# Altium schematic sheet Sheet_3.3VTo12V.SchDoc
size A4
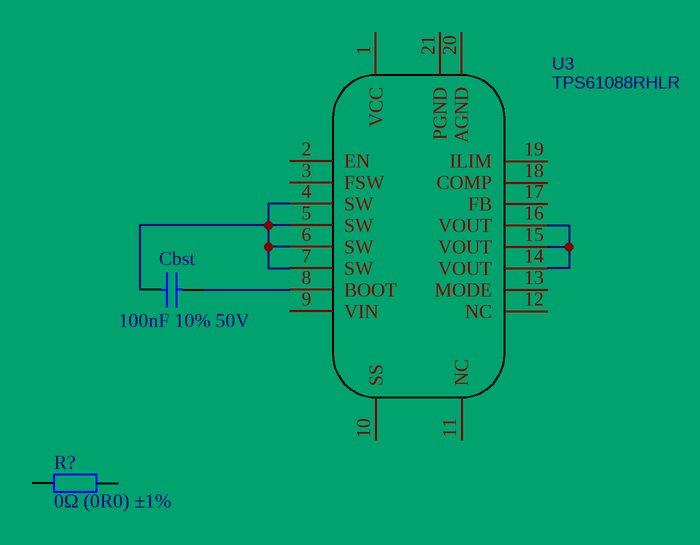
[diagram p0: Sheet_3.3VTo12V.SchDoc]

## Parts
Cbst  100nF 10% 50V  [1206_C]
R?  0Ω (0R0) ±1%  [1206_R]
U3  TPS61088RHLR  [VQFN-20_L4.6-W3.6-P0.50-BL]

## Nets
NetCbst_1: Cbst.1 U3.8(BOOT)
NetCbst_2: Cbst.2 U3.4(SW) U3.5(SW) U3.6(SW) U3.7(SW)
NetU3_14: U3.14(VOUT) U3.15(VOUT) U3.16(VOUT)

Not connected (* = marked no-connect by the designer): R? 1 2; U3 1(VCC) 2(EN) 3(FSW) 9(VIN) 10(SS) 11(NC) 12(NC) 13(MODE) 17(FB) 18(COMP) 19(ILIM) 20(AGND) 21(PGND)

## Library data of the parts
Cbst = 1206 1uF (105) 10% 50V: 贴片电容; ComponentLink1Description: 供应商链接; ComponentLink1URL: http://www.szlcsc.com/product/details_2200.html; Package: 1206; Supplier: LC; SuppliersPartNumber: C1848
R? = 1206 0Ω (0R0) 1%: 贴片电阻; ComponentLink1Description: 供应商链接; ComponentLink1URL: http://www.szlcsc.com/product/details_18576.html; Package: 1206; Supplier: LC; SuppliersPartNumber: C17888
U3 = TPS61088RHLR: BOM_Manufacturer: TI; SMT Type: Extend; BOM_Supplier: LCSC; BOM_Manufacturer Part: TPS61088RHLR; BOM_Supplier Part: C87357; BOM_LCSC Assembly: Yes; spicePre: U; spiceSymbolName: TPS61088RHLR